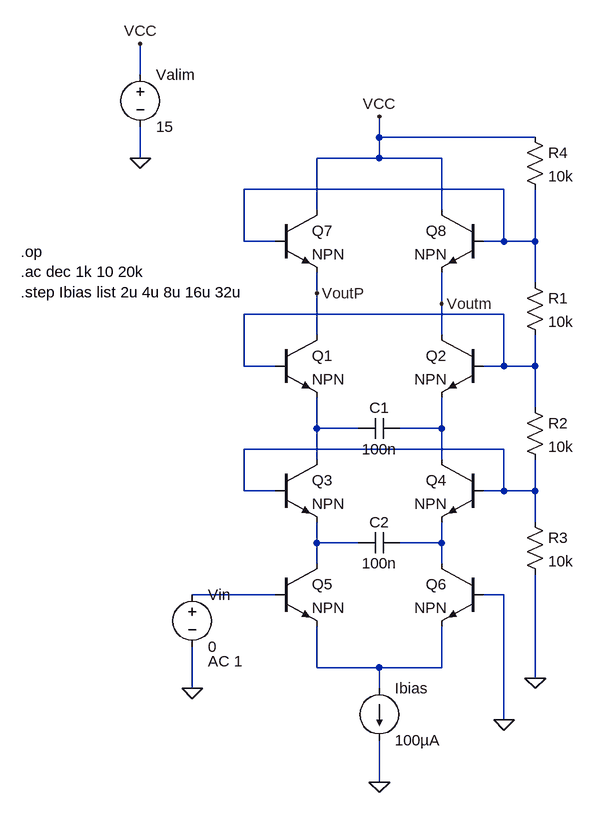
[diagram p0: schematic moog-filter-v1.asc]
moog-filter-v1.asc, the LTspice schematic file:
Version 4
SHEET 1 984 752
WIRE 48 -352 48 -400
WIRE 416 -256 416 -288
WIRE 656 -256 416 -256
WIRE 48 -224 48 -272
WIRE 416 -224 416 -256
WIRE 416 -224 320 -224
WIRE 512 -224 416 -224
WIRE 608 -176 208 -176
WIRE 320 -144 320 -224
WIRE 512 -144 512 -224
WIRE 208 -96 208 -176
WIRE 256 -96 208 -96
WIRE 608 -96 608 -176
WIRE 608 -96 576 -96
WIRE 656 -96 656 -176
WIRE 656 -96 608 -96
WIRE 656 -32 656 -96
WIRE 320 -16 320 -48
WIRE 512 0 512 -48
WIRE 608 16 208 16
WIRE 320 48 320 -16
WIRE 512 48 512 0
WIRE 208 96 208 16
WIRE 256 96 208 96
WIRE 608 96 608 16
WIRE 608 96 576 96
WIRE 656 96 656 48
WIRE 656 96 608 96
WIRE 656 160 656 96
WIRE 320 192 320 144
WIRE 384 192 320 192
WIRE 512 192 512 144
WIRE 512 192 448 192
WIRE 608 224 208 224
WIRE 320 240 320 192
WIRE 512 240 512 192
WIRE 208 288 208 224
WIRE 256 288 208 288
WIRE 608 288 608 224
WIRE 608 288 576 288
WIRE 656 288 656 240
WIRE 656 288 608 288
WIRE 656 336 656 288
WIRE 320 368 320 336
WIRE 384 368 320 368
WIRE 512 368 512 336
WIRE 512 368 448 368
WIRE 320 400 320 368
WIRE 512 400 512 368
WIRE 256 448 128 448
WIRE 608 448 576 448
WIRE 320 560 320 496
WIRE 416 560 320 560
WIRE 512 560 512 496
WIRE 512 560 416 560
WIRE 656 576 656 416
WIRE 128 592 128 528
WIRE 416 592 416 560
WIRE 608 640 608 448
WIRE 416 736 416 672
FLAG 416 -288 VCC
FLAG 656 576 0
FLAG 416 736 0
FLAG 48 -400 VCC
FLAG 48 -224 0
FLAG 608 640 0
FLAG 128 592 0
FLAG 320 -16 VoutP
FLAG 512 0 Voutm
DATAFLAG 208 16 "$"
DATAFLAG 608 16 "$"
DATAFLAG 608 224 "$"
DATAFLAG 208 224 "$"
DATAFLAG 608 448 "$"
DATAFLAG 224 448 "$"
DATAFLAG 576 -176 "$"
DATAFLAG 208 -176 "$"
DATAFLAG 416 560 "$"
DATAFLAG 512 368 "$"
DATAFLAG 320 368 "$"
DATAFLAG 512 192 "$"
DATAFLAG 320 192 "$"
DATAFLAG 320 48 "$"
DATAFLAG 512 48 "$"
SYMBOL npn 256 48 R0
SYMATTR InstName Q1
SYMBOL npn 576 48 M0
SYMATTR InstName Q2
SYMBOL npn 256 240 R0
SYMATTR InstName Q3
SYMBOL npn 576 240 M0
SYMATTR InstName Q4
SYMBOL npn 256 400 R0
SYMATTR InstName Q5
SYMBOL npn 576 400 M0
SYMATTR InstName Q6
SYMBOL current 416 592 R0
SYMATTR InstName Ibias
SYMATTR Value 100µA
SYMBOL cap 448 176 R90
WINDOW 0 0 32 VBottom 2
WINDOW 3 32 32 VTop 2
SYMATTR InstName C1
SYMATTR Value 100n
SYMBOL cap 448 352 R90
WINDOW 0 0 32 VBottom 2
WINDOW 3 32 32 VTop 2
SYMATTR InstName C2
SYMATTR Value 100n
SYMBOL res 640 -48 R0
SYMATTR InstName R1
SYMATTR Value 10k
SYMBOL res 640 144 R0
SYMATTR InstName R2
SYMATTR Value 10k
SYMBOL res 640 320 R0
SYMATTR InstName R3
SYMATTR Value 10k
SYMBOL npn 256 -144 R0
SYMATTR InstName Q7
SYMBOL npn 576 -144 M0
SYMATTR InstName Q8
SYMBOL res 640 -272 R0
SYMATTR InstName R4
SYMATTR Value 10k
SYMBOL voltage 48 -368 R0
SYMATTR InstName Valim
SYMATTR Value 15
SYMBOL voltage 128 432 R0
WINDOW 123 24 118 Left 2
SYMATTR Value2 AC 1
SYMATTR InstName Vin
SYMATTR Value 0
TEXT -136 -80 Left 2 !.op\n.ac dec 1k 10 20k\n.step Ibias list 2u 4u 8u 16u 32u

The netlist it stands for:
* moog-filter-v1.asc
Q1 VoutP N002 N003 0 NPN
Q2 Voutm N002 N004 0 NPN
Q3 N003 N005 N006 0 NPN
Q4 N004 N005 N007 0 NPN
Q5 N006 N008 N009 0 NPN
Q6 N007 0 N009 0 NPN
Ibias N009 0 100µA
C1 N004 N003 100n
C2 N007 N006 100n
R1 N001 N002 10k
R2 N002 N005 10k
R3 N005 0 10k
Q7 VCC N001 VoutP 0 NPN
Q8 VCC N001 Voutm 0 NPN
R4 VCC N001 10k
Valim VCC 0 15
Vin N008 0 0 AC 1
.model NPN NPN
.model PNP PNP
.lib standard.bjt
.op
.ac dec 1k 10 20k
.step Ibias list 2u 4u 8u 16u 32u
.backanno
.end